# EAGLE design Tecleator (EAGLE 7.3.0)
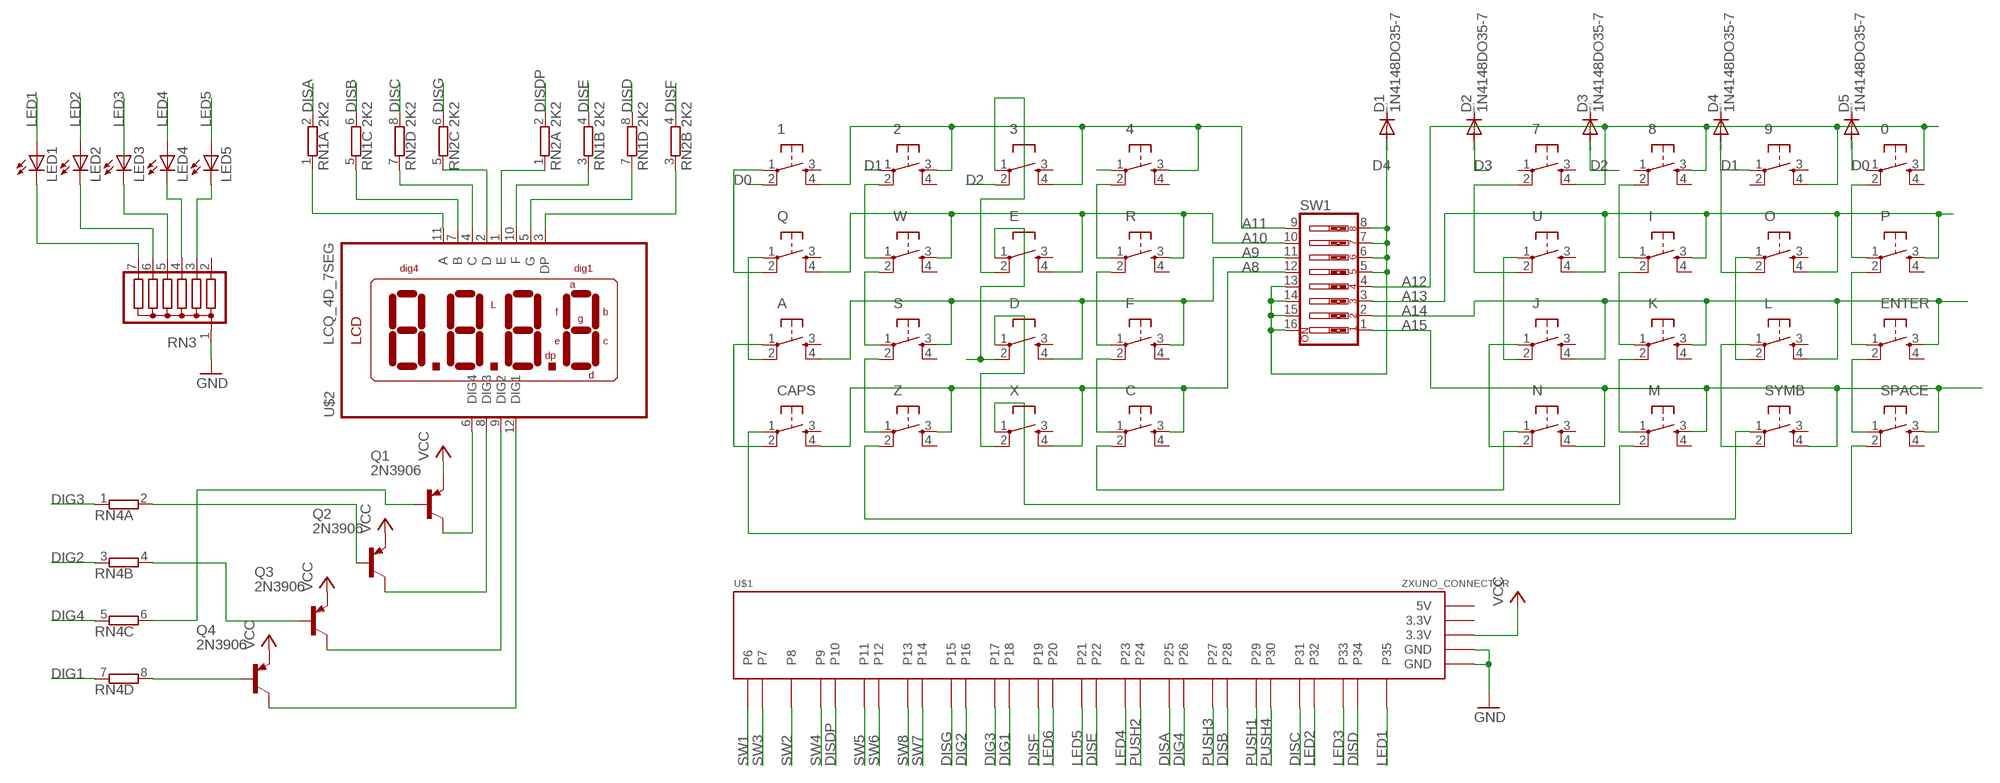
[diagram p0: schematic, sheet 1]

## Parts
0  DTS-6  [DTS-6]
1  DTS-6  [DTS-6]
2  DTS-6  [DTS-6]
3  DTS-6  [DTS-6]
4  DTS-6  [DTS-6]
7  DTS-6  [DTS-6]
8  DTS-6  [DTS-6]
9  DTS-6  [DTS-6]
A  DTS-6  [DTS-6]
C  DTS-6  [DTS-6]
CAPS  DTS-6  [DTS-6]
D  DTS-6  [DTS-6]
D1  1N4148DO35-7  [DO35-7]
D2  1N4148DO35-7  [DO35-7]
D3  1N4148DO35-7  [DO35-7]
D4  1N4148DO35-7  [DO35-7]
D5  1N4148DO35-7  [DO35-7]
E  DTS-6  [DTS-6]
ENTER  DTS-6  [DTS-6]
F  DTS-6  [DTS-6]
I  DTS-6  [DTS-6]
J  DTS-6  [DTS-6]
K  DTS-6  [DTS-6]
L  DTS-6  [DTS-6]
LED1  LED3MM  [LED3MM]
LED2  LED3MM  [LED3MM]
LED3  LED3MM  [LED3MM]
LED4  LED3MM  [LED3MM]
LED5  LED3MM  [LED3MM]
M  DTS-6  [DTS-6]
N  DTS-6  [DTS-6]
O  DTS-6  [DTS-6]
P  DTS-6  [DTS-6]
Q  DTS-6  [DTS-6]
Q1  2N3906  [TO92]
Q2  2N3906  [TO92]
Q3  2N3906  [TO92]
Q4  2N3906  [TO92]
R  DTS-6  [DTS-6]
RN1  2K2  E4R  [SIL8]
RN2  2K2  E4R  [SIL8]
RN3  G06R  [SIL7]
RN4  E4R  [SIL8]
S  DTS-6  [DTS-6]
SPACE  DTS-6  [DTS-6]
SW1  SW_DIP-8  [EDG-08]
SYMB  DTS-6  [DTS-6]
U  DTS-6  [DTS-6]
U$1  ZXUNO_CONNECTOR  [ZXUNO_CONNECTOR]
U$2  LCQ_4D_7SEG  [LDQ_4D_7SEG]
W  DTS-6  [DTS-6]
X  DTS-6  [DTS-6]
Z  DTS-6  [DTS-6]

## Nets
A8: C.3 CAPS.4 SW1.12 X.4 Z.3
A9: A.4 D.4 F.3 S.3 SW1.11
A10: E.4 Q.4 R.3 SW1.10 W.3
A11: 1.4 2.3 3.4 4.3 SW1.9
A12: 0.3 7.4 8.3 9.4 SW1.4
A13: I.3 O.4 P.3 SW1.3 U.4
A14: ENTER.3 J.4 K.3 L.4 SW1.2
A15: M.3 N.4 SPACE.3 SW1.1 SYMB.4
D0: 1.2 D5.A
D1: 2.1 9.1 D4.A O.2
D2: 3.2 D3.A
D3: 4.1 D2.A
D4: D1.A SW1.5 SW1.6 SW1.7 SW1.8 SW1.13 SW1.14 SW1.15 SW1.16
DIG1: RN4.7 U$1.P18
DIG2: RN4.3 U$1.P16
DIG3: RN4.1 U$1.P17
DIG4: RN4.5 U$1.P26
DISA: RN1.2 U$1.P25
DISB: RN1.6 U$1.P28
DISC: RN2.8 U$1.P31
DISD: RN1.8 U$1.P34
DISDP: RN2.2 U$1.P10
DISE: RN1.4 U$1.P22
DISF: RN2.4 U$1.P19
DISG: RN2.6 U$1.P15
ELETE: M.2 X.1
GND: RN3.1 U$1.GND@1(GND) U$1.GND@2(GND)
LED1: LED1.A U$1.P35
LED2: LED2.A U$1.P32
LED3: LED3.A U$1.P33
LED4: LED4.A U$1.P23
LED5: LED5.A U$1.P21
LED6: U$1.P20
N$1: CAPS.1 SPACE.2
N$2: 1.1 Q.2
N$3: K.2 M.1
N$4: Q1.1(C) U$2.6(DIG4)
N$5: Q2.1(C) U$2.8(DIG3)
N$6: Q3.1(C) U$2.9(DIG2)
N$7: A.2 Q.1
N$8: Q4.1(C) U$2.12(DIG1)
N$9: A.1 CAPS.2
N$10: 7.2 U.2
N$13: 3.1 E.2
N$14: S.1 W.2
N$15: S.2 Z.1
N$16: SYMB.1 Z.2
N$20: Q4.2(B) RN4.8
N$21: RN1.1 U$2.11(A)
N$23: 4.2 R.1
N$24: F.1 R.2
N$25: C.1 F.2
N$27: J.2 U.1
N$28: J.1 N.2
N$30: RN1.5 U$2.7(B)
N$31: D.2 E.1
N$32: 2.2 W.1
N$33: RN2.7 U$2.4(C)
N$34: RN2.5 U$2.2(D)
N$35: RN2.1 U$2.1(E)
N$36: RN1.3 U$2.10(F)
N$37: LED4.K(C) RN3.4
N$38: LED5.K(C) RN3.3
N$40: LED3.K(C) RN3.5
N$41: LED2.K(C) RN3.6
N$43: C.2 N.1
N$44: L.1 SYMB.2
N$46: LED1.K(C) RN3.7
N$47: I.2 K.1
N$48: 8.2 I.1
N$49: L.2 O.1
N$51: RN1.7 U$2.5(G)
N$52: ENTER.2 SPACE.1
N$53: ENTER.1 P.2
N$54: 0.2 P.1
N$55: RN2.3 U$2.3(DP)
N$56: Q2.2(B) RN4.2
N$59: Q1.2(B) RN4.6
N$60: Q3.2(B) RN4.4
N$74: D.1 X.2
PUSH1: U$1.P29
PUSH2: U$1.P24
PUSH3: U$1.P27
PUSH4: U$1.P30
SW1: U$1.P6
SW2: U$1.P8
SW3: U$1.P7
SW4: U$1.P9
SW5: U$1.P11
SW6: U$1.P12
SW7: U$1.P14
SW8: U$1.P13
VCC: Q1.3(E) Q2.3(E) Q3.3(E) Q4.3(E) U$1.3.3V@2(3.3V)
Unconnected: 0.1 0.4 1.3 2.4 3.3 4.4 7.1 7.3 8.1 8.4 9.2 9.3 A.3 C.4 CAPS.3 D1.C D2.C D3.C D4.C D5.C D.3 E.3 ENTER.4 F.4 I.4 J.3 K.4 L.3 M.4 N.3 O.3 P.4 Q.3 R.4 RN3.2 S.4 SPACE.4 SYMB.3 U.3 W.4 X.3 Z.4

## Power pins joined to a net without a drawn wire
3.3V: U$1.3.3V@1(3.3V)
5V: U$1.5V

## Library data of the parts
0 1-4 7-9 A C CAPS D E ENTER F I J K L M N O P Q R S SPACE SYMB U W X Z = switch-tact:DTS-6
D1-D5 = diode:1N4148: DIODE high speed (Philips)
LED1-LED5 = led:LED: LED OSRAM: - CHIPLED LG R971, LG N971, LY N971, LG Q971, LY Q971, LO R971, LY R971 LH N974, LH R974 LS Q976, LO Q976, LY Q976 LO Q996 - Hyper CHIPLED LW Q18S LB Q993, LB Q99A, LB R99A - SideLED LS A670, LO A670, LY A670, LG A670, LP A670 LB A673, LV A673, LT A673, LW A673 LH A674 LY A675 LS A676, LA A676, LO A676, LY A676, LW A676 LS A679, LY A679, LG A679 - Hyper Micro SIDELED® LS Y876, LA Y876, LO Y876, LY Y876 LT Y87S - SmartLED LW L88C, LW L88S LB L89C, LB L89S, LG L890 LS L89K, LO L89K, LY L89K LS L896, LA L896, LO L896, LY L896 - TOPLED LS T670, LO T670, LY T670, LG T670, LP T670 LSG T670, LSP T670, LSY T670, LOP T670, LYG T670 LG T671, LOG T671, LSG T671 LB T673, LV T673, LT T673, LW T673 LH T674 LS T676, LA T676, LO T676, LY T676, LB T676, LH T676, LSB T676, LW T676 LB T67C, LV T67C, LT T67C, LS T67K, LO T67K, LY T67K, LW E67C LS E67B, LA E67B, LO E67B, LY E67B, LB E67C, LV E67C, LT E67C LW T67C LS T679, LY T679, LG T679 LS T770, LO T770, LY T770, LG T770, LP T770 LB T773, LV T773, LT T773, LW T773 LH T774 LS E675, LA E675, LY E675, LS T675 LS T776, LA T776, LO T776, LY T776, LB T776 LHGB T686 LT T68C, LB T68C - Hyper Mini TOPLED® LB M676 - Mini TOPLED Santana® LG M470 LS M47K, LO M47K, LY M47K Source: http://www.osram.convergy.de LUXEON: - LUMILED® LXK2-PW12-R00, LXK2-PW12-S00, LXK2-PW14-U00, LXK2-PW14-V00 LXK2-PM12-R00, LXK2-PM12-S00, LXK2-PM14-U00 LXK2-PE12-Q00, LXK2-PE12-R00, LXK2-PE12-S00, LXK2-PE14-T00, LXK2-PE14-U00 LXK2-PB12-K00, LXK2-PB12-L00, LXK2-PB12-M00, LXK2-PB14-N00, LXK2-PB14-P00, LXK2-PB14-Q00 LXK2-PR12-L00, LXK2-PR12-M00, LXK2-PR14-Q00, LXK2-PR14-R00 LXK2-PD12-Q00, LXK2-PD12-R00, LXK2-PD12-S00 LXK2-PH12-R00, LXK2-PH12-S00 LXK2-PL12-P00, LXK2-PL12-Q00, LXK2-PL12-R00 Source: www.luxeon.com KINGBRIGHT: KA-3528ASYC Source: www.kingbright.com
Q1-Q4 = transistor-pnp:2N3906: PNP Transistor
RN1 RN2 RN4 = resistor-sil:E4R: SIL RESISTOR; OC_FARNELL: unknown; OC_NEWARK: unknown
RN3 = resistor-sil:G06R: SIL RESISTOR; OC_FARNELL: unknown; OC_NEWARK: unknown
SW1 = special:SW_DIP-8: DIP SWITCH
U$1 = zxuno:ZXUNO_CONNECTOR
U$2 = mylib:LCQ_4D_7SEG

## Board
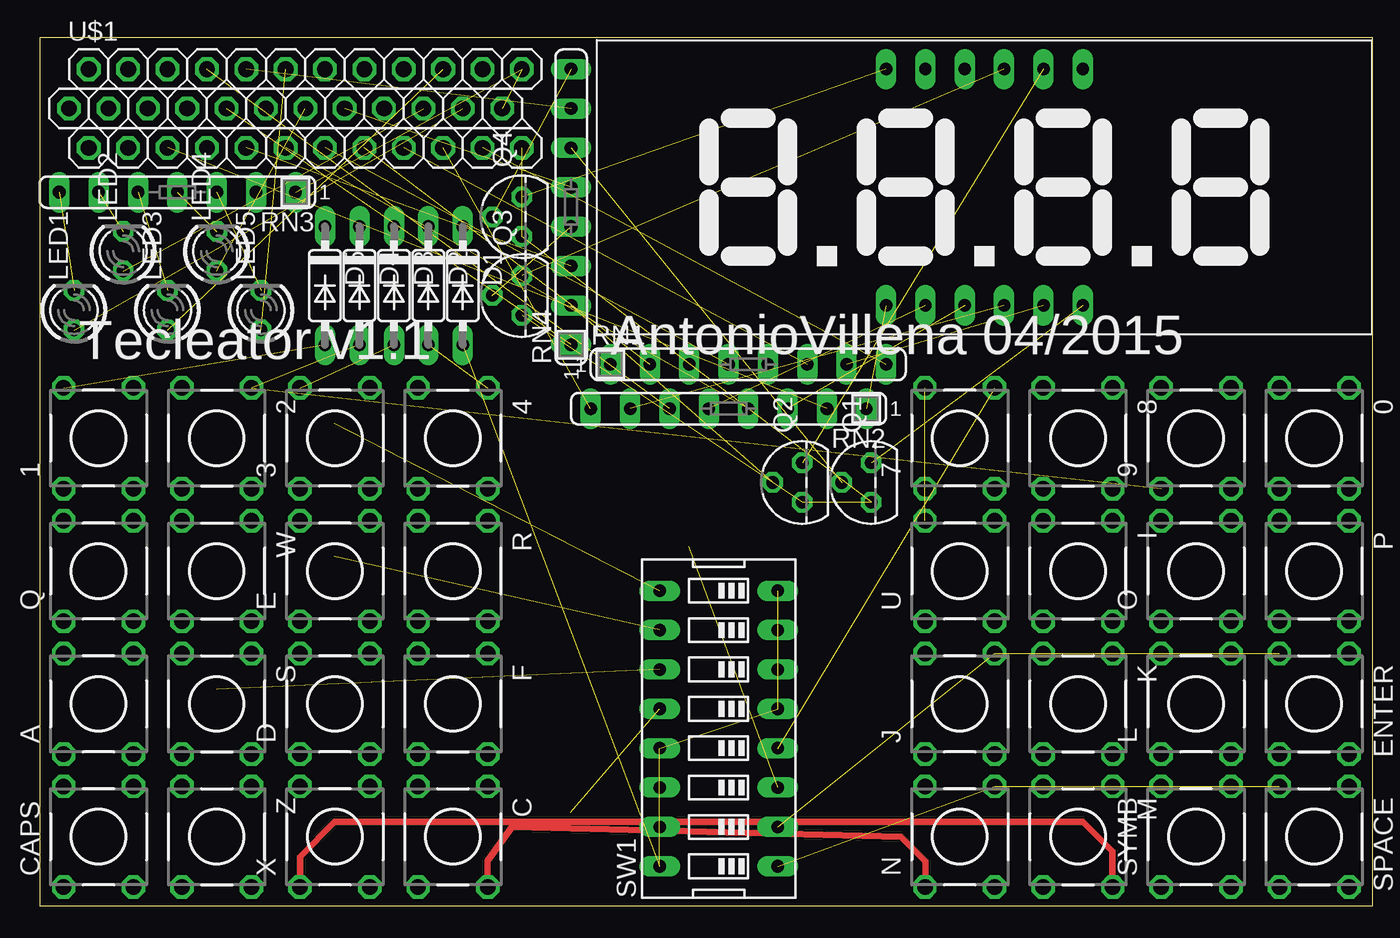
[diagram p1: board, top side]
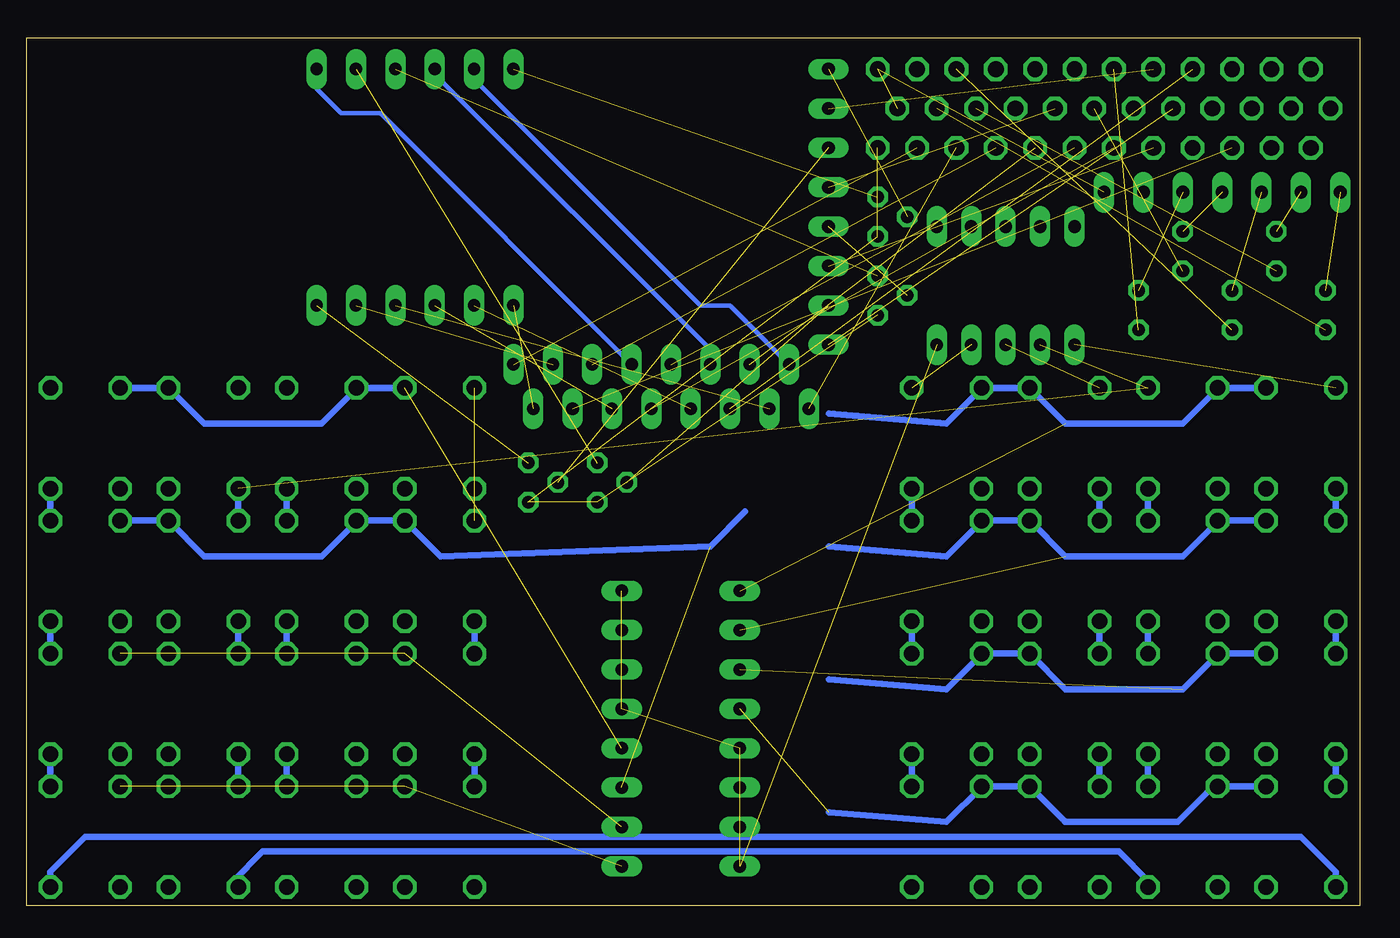
[diagram p2: board, bottom side, seen from below]

No outline drawn. Coordinates in mm, seen from the top.
Copper layers (1*16): Top 0.035mm / dielectric 1.5mm / Bottom 0.035mm
Design rules "default": minimum track width 10mil, minimum drill 24mil, track to track 8mil, track to pad 8mil, pad to pad 8mil, via to via 8mil, smd to smd 8mil, copper to edge 40mil, drill to drill 8mil, minimum pad ring 10mil, minimum via ring 8mil, stop-mask expansion 4mil, vias tented up to drill 0mil, thermal gap 10mil
Milling: 4 lines

### Footprints (pad centres in the part's own frame; a part is rotated, then mirrored left to right if it is on the bottom)
DTS-6 = drill 1 octagon: 1 -3.25,2.25; 2 3.25,2.25; 3 -3.25,-2.25; 4 3.25,-2.25
DO35-7 = drill 0.813 long: A 3.81,0; C -3.81,0
LED3MM = drill 0.813 octagon: A -1.27,0; K 1.27,0
TO92 = drill 0.813 octagon: 1 1.27,0; 2 0,1.905; 3 -1.27,0
SIL8 = drill 0.813 long: 1 -8.89,0; 2 -6.35,0; 3 -3.81,0; 4 -1.27,0; 5 1.27,0; 6 3.81,0; 7 6.35,0; 8 8.89,0
SIL7 = drill 0.813 long: 1 -7.62,0; 2 -5.08,0; 3 -2.54,0; 4 0,0; 5 2.54,0; 6 5.08,0; 7 7.62,0
EDG-08 = drill 0.813 long: 1 -8.89,-3.81; 2 -6.35,-3.81; 3 -3.81,-3.81; 4 -1.27,-3.81; 5 1.27,-3.81; 6 3.81,-3.81; 7 6.35,-3.81; 8 8.89,-3.81; 9 8.89,3.81; 10 6.35,3.81; 11 3.81,3.81; 12 1.27,3.81; 13 -1.27,3.81; 14 -3.81,3.81; 15 -6.35,3.81; 16 -8.89,3.81
ZXUNO_CONNECTOR = drill 1.016 octagon: 3.3V@1 -13.97,0; 3.3V@2 15.24,-2.54; 5V -12.7,-2.54; GND@1 15.24,2.54; GND@2 13.97,0; NC@1 12.7,2.54; P6 -12.7,2.54; P7 -10.16,-2.54; P8 -11.43,0; P9 -10.16,2.54; P10 -7.62,-2.54; P11 -8.89,0; P12 -7.62,2.54; P13 -5.08,-2.54; P14 -6.35,0; P15 -5.08,2.54; P16 -2.54,-2.54; P17 -3.81,0; P18 -2.54,2.54; P19 0,-2.54; P20 -1.27,0; P21 0,2.54; P22 2.54,-2.54; P23 1.27,0; P24 2.54,2.54; P25 5.08,-2.54; P26 3.81,0; P27 5.08,2.54; P28 7.62,-2.54; P29 6.35,0; P30 7.62,2.54; P31 10.16,-2.54; P32 8.89,0; P33 10.16,2.54; P34 12.7,-2.54; P35 11.43,0
LDQ_4D_7SEG = drill 0.8 long: 1 -6.35,-7.62; 2 -3.81,-7.62; 3 -1.27,-7.62; 4 1.27,-7.62; 5 3.81,-7.62; 6 6.35,-7.62; 7 6.35,7.62; 8 3.81,7.62; 9 1.27,7.62; 10 -1.27,7.62; 11 -3.81,7.62; 12 -6.35,7.62

### Placement (x,y rotation side)
0  82.23,30.16 270 top
1  3.81,30.16 90 top
2  11.43,30.16 270 top
3  19.05,30.16 90 top
4  26.67,30.16 270 top
7  59.37,30.16 90 top
8  66.99,30.16 270 top
9  74.61,30.16 90 top
A  3.81,13.02 90 top
C  26.67,4.45 270 top
CAPS  3.81,4.45 90 top
D  19.05,13.02 90 top
D1  27.3,40.01 270 top
D2  25.08,40.01 270 top
D3  22.86,40.01 270 top
D4  20.64,40.01 270 top
D5  18.41,40.01 270 top
E  19.05,21.59 90 top
ENTER  82.23,13.02 270 top
F  26.67,13.02 270 top
I  66.99,21.59 270 top
J  59.37,13.02 90 top
K  66.99,13.02 270 top
L  74.61,13.02 90 top
LED1  2.22,38.42 90 top
LED2  5.4,42.23 90 top
LED3  8.26,38.42 90 top
LED4  11.43,42.23 90 top
LED5  14.29,38.42 90 top
M  66.99,4.45 270 top
N  59.37,4.45 90 top
O  74.61,21.59 90 top
P  82.23,21.59 270 top
Q  3.81,21.59 90 top
Q1  53.66,27.3 90 top
Q2  49.21,27.3 90 top
Q3  31.11,39.37 90 top
Q4  31.11,44.45 90 top
R  26.67,21.59 270 top
RN1  45.72,34.92 0 top
RN2  44.45,32.07 180 top
RN3  8.89,46.04 180 top
RN4  34.29,45.09 90 top
S  11.43,13.02 270 top
SPACE  82.23,4.45 270 top
SW1  43.81,11.43 90 top
SYMB  74.61,4.45 90 top
U  59.37,21.59 90 top
U$1  15.88,51.44 0 top
U$2  60.96,46.35 0 top
W  11.43,21.59 270 top
X  19.05,4.45 90 top
Z  11.43,4.45 270 top

### Tracks (layer width: path | path; a pad name or v marks a point on that pad's centre or on a via)
A8  (1 unrouted)
  Bottom 0.406: CAPS.4 Z.3 9.45,7.7 11.75,5.4 19.05,5.4 19.05,5.45 X.4 C.3 24.42,7.65 26.67,5.4 34.24,6.03
A9  (1 unrouted)
  Bottom 0.406: A.4 S.3 9.18,16.22 11.43,13.97 19,13.97 D.4 F.3 24.42,16.22 26.67,13.97 34.24,14.61
A10  (1 unrouted)
  Bottom 0.406: Q.4 W.3 9.18,24.79 11.43,22.54 19,22.54 E.4 R.3 24.42,24.79 26.67,22.54 34.24,23.18
A11  (1 unrouted)
  Bottom 0.406: 1.4 2.3 9.18,33.37 11.43,31.11 19,31.11 3.4 4.3 24.42,33.37 26.67,31.11 34.24,31.75
A12  (1 unrouted)
  Bottom 0.406: 0.3 9.4 74.56,31.11 66.99,31.11 64.74,33.37 8.3 7.4
A13  (1 unrouted)
  Bottom 0.406: P.3 O.4 74.56,22.54 66.99,22.54 64.74,24.79 I.3 U.4 59.33,22.54 41.91,23.18 39.66,25.43
A14  (4 unrouted)
A15  (4 unrouted)
D0  (1 unrouted)
D1  (2 unrouted)
  Bottom 0.406: O.2 9.1
D2  (1 unrouted)
D3  (1 unrouted)
D4  (8 unrouted)
DIG1  (1 unrouted)
DIG2  (1 unrouted)
DIG3  (1 unrouted)
DIG4  (1 unrouted)
DISA  (1 unrouted)
DISB  (1 unrouted)
DISC  (1 unrouted)
DISD  (1 unrouted)
DISDP  (1 unrouted)
DISE  (1 unrouted)
DISF  (1 unrouted)
DISG  (1 unrouted)
ELETE
  Top 0.406: X.1 16.8,3.15 19.05,5.4 67.31,5.4 69.22,3.49 69.22,1.22 M.2
GND  (2 unrouted)
LED1  (1 unrouted)
LED2  (1 unrouted)
LED3  (1 unrouted)
LED4  (1 unrouted)
LED5  (1 unrouted)
N$1
  Bottom 0.406: CAPS.1 1.56,2.19 3.81,4.45 82.23,4.45 84.48,2.19 SPACE.2
N$2
  Bottom 0.406: 1.1 Q.2
N$3
  Bottom 0.406: M.1 K.2
N$4  (1 unrouted)
N$5  (1 unrouted)
N$6  (1 unrouted)
N$7
  Bottom 0.406: Q.1 A.2
N$8  (1 unrouted)
N$9
  Bottom 0.406: A.1 CAPS.2
N$10  (1 unrouted)
N$13
  Bottom 0.406: E.2 3.1
N$14
  Bottom 0.406: S.1 W.2
N$15
  Bottom 0.406: Z.1 S.2
N$16
  Bottom 0.406: Z.2 13.68,1.61 15.56,3.49 70.8,3.49 72.71,1.59 72.71,1.54 SYMB.1
N$20  (1 unrouted)
N$21
  Bottom 0.305: U$2.11 57.15,53.34 42.55,38.73 40.64,38.73 RN1.1
N$23
  Bottom 0.406: R.1 4.2
N$24
  Bottom 0.406: F.1 R.2
N$25
  Bottom 0.406: C.1 F.2
N$27
  Bottom 0.406: J.2 U.1
N$28
  Bottom 0.406: N.2 J.1
N$30
  Bottom 0.305: U$2.7 67.31,52.7 65.72,51.12 63.18,51.12 RN1.5
N$31
  Bottom 0.406: D.2 E.1
N$32
  Bottom 0.406: W.1 2.2
N$33  (1 unrouted)
N$34  (1 unrouted)
N$35  (1 unrouted)
N$36
  Bottom 0.305: U$2.10 59.69,53.66 41.91,35.88 RN1.3
N$37  (1 unrouted)
N$38  (1 unrouted)
N$40  (1 unrouted)
N$41  (1 unrouted)
N$43
  Top 0.406: C.2 28.92,2.88 30.48,5.08 55.56,4.45 57.15,2.86 57.15,1.22 N.1
N$44
  Bottom 0.406: SYMB.2 L.1
N$46  (1 unrouted)
N$47
  Bottom 0.406: K.1 I.2
N$48
  Bottom 0.406: I.1 8.2
N$49
  Bottom 0.406: L.2 O.1
N$51  (1 unrouted)
N$52
  Bottom 0.406: SPACE.1 ENTER.2
N$53
  Bottom 0.406: ENTER.1 P.2
N$54
  Bottom 0.406: P.1 0.2
N$55  (1 unrouted)
N$56  (1 unrouted)
N$59  (1 unrouted)
N$60  (1 unrouted)
N$74
  Bottom 0.406: X.2 D.1
VCC  (4 unrouted)

### Text on the board
tNames: AntonioVillena 04/2015 | Tecleator v1.1